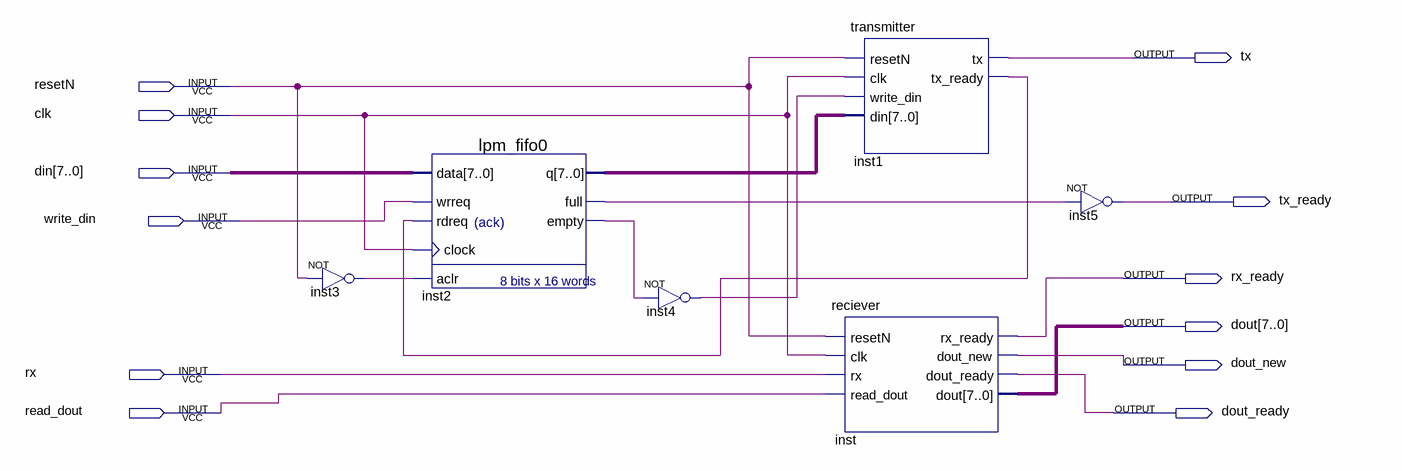
[diagram p0: schematic sheet]
// Quartus schematic UART.bdf as structural Verilog: 6 symbols, 12 pins
module UART (
  input  resetN,
  input  clk,
  input  [7:0] din,
  input  write_din,
  input  rx,
  input  read_dout,
  output tx,
  output tx_ready,
  output rx_ready,
  output [7:0] dout,
  output dout_new,
  output dout_ready
);

  wire inst1_tx_ready, inst2_empty, inst2_full, inst3_out, inst4_out;
  wire [7:0] inst2_q;

  not inst3 (inst3_out, resetN);
  lpm_fifo0 inst2 (
    .data(din), .wrreq(write_din), .rdreq(inst1_tx_ready), .clock(clk), .aclr(inst3_out), .q(inst2_q),
    .full(inst2_full), .empty(inst2_empty));
  not inst4 (inst4_out, inst2_empty);
  transmitter inst1 (
    .resetN(resetN), .clk(clk), .write_din(inst4_out), .din(inst2_q), .tx(tx), .tx_ready(inst1_tx_ready));
  reciever inst (
    .resetN(resetN), .clk(clk), .rx(rx), .read_dout(read_dout), .rx_ready(rx_ready), .dout_new(dout_new),
    .dout_ready(dout_ready), .dout(dout));
  not inst5 (tx_ready, inst2_full);
endmodule
